# Altium project IRNAS_powerboard.PrjPcb
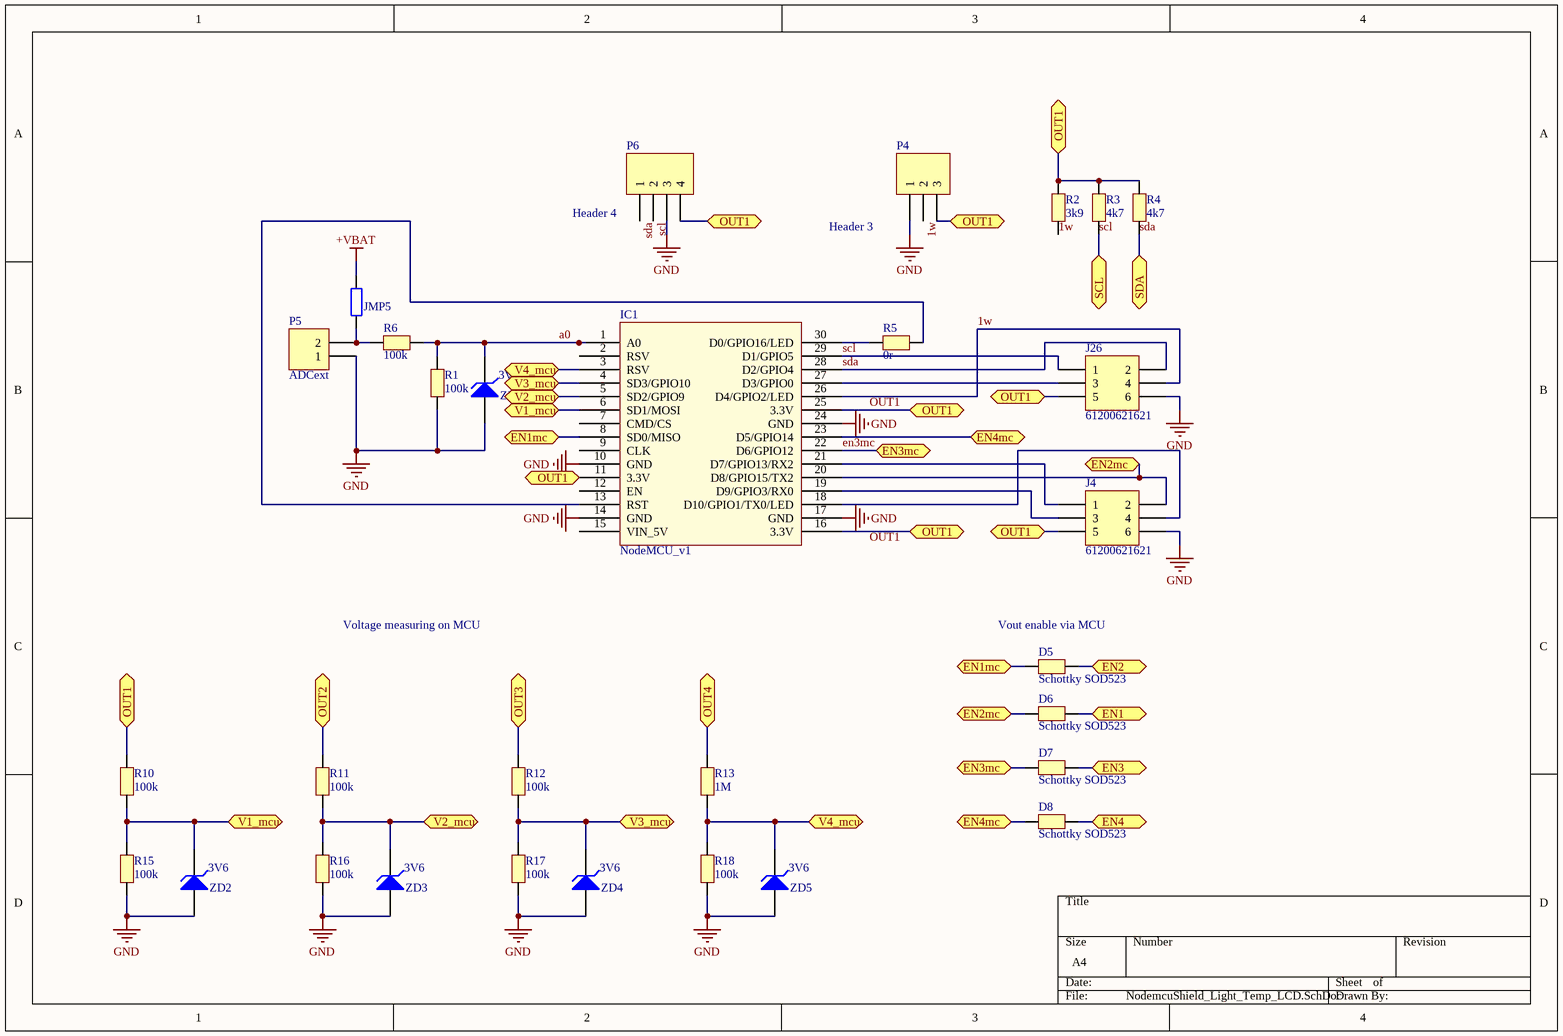
[diagram p0: NodemcuShield_Light_Temp_LCD.SchDoc]
3 sheets, 105 parts. Net scope: flat (ports and power ports of the same name join across sheets).
Board file: _Mainboard 1.1.PcbDoc
Sheets:
  NodemcuShield_Light_Temp_LCD.SchDoc
  _Mainboard.SchDoc
  Main_capacitors.SchDoc

## Sheet NodemcuShield_Light_Temp_LCD.SchDoc
size A4

### Parts
D5  Schottky SOD523  [SOD523]
D6  Schottky SOD523  [SOD523]
D7  Schottky SOD523  [SOD523]
D8  Schottky SOD523  [SOD523]
IC1  NodeMCU_v1  [Nodemcu]
J4  61200621621  [61200621621]
J26  61200621621  [61200621621]
JMP5  Resistor generic  [0603 RES]  (value not drawn)
P4  Header 3  [HDR1X3]
P5  ADCext  [HDR1X2]
P6  Header 4  [HDR1X4]
R1  100k  [0603 RES]
R2  3k9  [0603 RES]
R3  4k7  [0603 RES]
R4  4k7  [0603 RES]
R5  0r  [0603 RES]
R6  100k  [0603 RES]
R10  100k  [0603 RES]
R11  100k  [0603 RES]
R12  100k  [0603 RES]
R13  1M  [0603 RES]
R15  100k  [0603 RES]
R16  100k  [0603 RES]
R17  100k  [0603 RES]
R18  100k  [0603 RES]
ZD1  Valve: 3V6  [MELF_diode]  (hidden comment: Diode Zener)
ZD2  Valve: 3V6  [MELF_diode]  (hidden comment: Diode Zener)
ZD3  Valve: 3V6  [MELF_diode]  (hidden comment: Diode Zener)
ZD4  Valve: 3V6  [MELF_diode]  (hidden comment: Diode Zener)
ZD5  Valve: 3V6  [MELF_diode]  (hidden comment: Diode Zener)

### Ports
EN1, EN1mc, EN2, EN2mc, EN3, EN3mc, EN4, EN4mc, OUT1, OUT2, OUT3, OUT4, SCL, SDA, V1_mcu, V2_mcu, V3_mcu, V4_mcu

### Nets
+VBAT: JMP5.2
GND: IC1.10(GND) IC1.14(GND) IC1.17(GND) IC1.24(GND) J4.6 J26.6 P4.1 P5.1 P6.3 R1.2 R15.2 R16.2 R17.2 R18.2 ZD1.1(A) ZD2.1(A) ZD3.1(A) ZD4.1(A) ZD5.1(A)
1w: IC1.26(D4/GPIO2/LED) J26.4 P4.2 R2.1
a0: IC1.1(A0) R1.1 R6.1 ZD1.2(K)
en3mc: D7.2 IC1.22(D6/GPIO12) ; port EN3mc
OUT1: IC1.11(3.3V) IC1.16(3.3V) IC1.25(3.3V) J4.5 J26.5 P4.3 P6.4 R2.2 R3.2 R4.2 R10.1 ; port OUT1
scl: IC1.29(D1/GPIO5) J26.1 P6.2 R3.1 ; port SCL
sda: IC1.28(D2/GPIO4) J26.2 P6.1 R4.1 ; port SDA
NetC5_2: R11.1 ; port OUT2
NetC9_2: R12.1 ; port OUT3
NetC13_2: R13.1 ; port OUT4
NetD1_2: D8.1 ; port EN4
NetD2_2: D7.1 ; port EN3
NetD3_2: D6.1 ; port EN1
NetD4_2: D5.1 ; port EN2
NetD5_2: D5.2 IC1.8(SD0/MISO) ; port EN1mc
NetD6_2: D6.2 IC1.20(D8/GPIO15/TX2) J4.2 ; port EN2mc
NetD8_2: D8.2 IC1.23(D5/GPIO14) ; port EN4mc
NetIC1_3: IC1.3(RSV) R13.2 R18.1 ZD5.2(K) ; port V4_mcu
NetIC1_4: IC1.4(SD3/GPIO10) R12.2 R17.1 ZD4.2(K) ; port V3_mcu
NetIC1_5: IC1.5(SD2/GPIO9) R11.2 R16.1 ZD3.2(K) ; port V2_mcu
NetIC1_6: IC1.6(SD1/MOSI) R10.2 R15.1 ZD2.2(K) ; port V1_mcu
NetIC1_13: IC1.13(RST) R5.1
NetIC1_18: IC1.18(D10/GPIO1/TX0/LED) J4.4
NetIC1_19: IC1.19(D9/GPIO3/RX0) J4.3
NetIC1_21: IC1.21(D7/GPIO13/RX2) J4.1
NetIC1_27: IC1.27(D3/GPIO0) J26.3
NetIC1_30: IC1.30(D0/GPIO16/LED) R5.2
NetJMP5_1: JMP5.1 P5.2 R6.2

Not connected (* = marked no-connect by the designer): IC1 2(RSV) 7(CMD/CS) 9(CLK) 12(EN) 15(VIN_5V)

### Notes on the sheet
- Voltage measuring on MCU
- (near D5) Vout enable via MCU
- Labels drawn without touching a wire or pin: OUT1

### Library data of the parts
D5-D8 = Resistor
IC1 = NodeMCU_v1: nodemcu
J4 J26 = 61200621621: WR-BHD 2.54mm Male Box Header; Manufacturer: Wurth Elektronik; ComponentLink1 Description: Manufacturer; ComponentLink2 Description: Datasheet; NoPins: 6; Created Date: March 2016; partNo: 61200621621; ComponentLink1URL: http://www.we-online.com; ComponentLink2URL: http://katalog.we-online.de/em/datasheet/6120xx21621.pdf; Created by: Baojun Chen
JMP5 = Resistor: Resistor SMD; Valve: *
P4 = Header 3: Header, 3-Pin; LatestRevisionDate: 17-Jul-2002; LatestRevisionNote: Re-released for DXP Platform.; Publisher: Altium Limited
P5 = Header 2: Header, 2-Pin; LatestRevisionDate: 17-Jul-2002; LatestRevisionNote: Re-released for DXP Platform.; Publisher: Altium Limited
P6 = Header 4: Header, 4-Pin; LatestRevisionDate: 17-Jul-2002; LatestRevisionNote: Re-released for DXP Platform.; Publisher: Altium Limited
R1-R6 = Resistor: Resistor 0603
R10-R13 R15-R18 = Resistor: Resistor 0805 smd
ZD1-ZD5 = Diode Zener: Zener

## Sheet _Mainboard.SchDoc
size A4
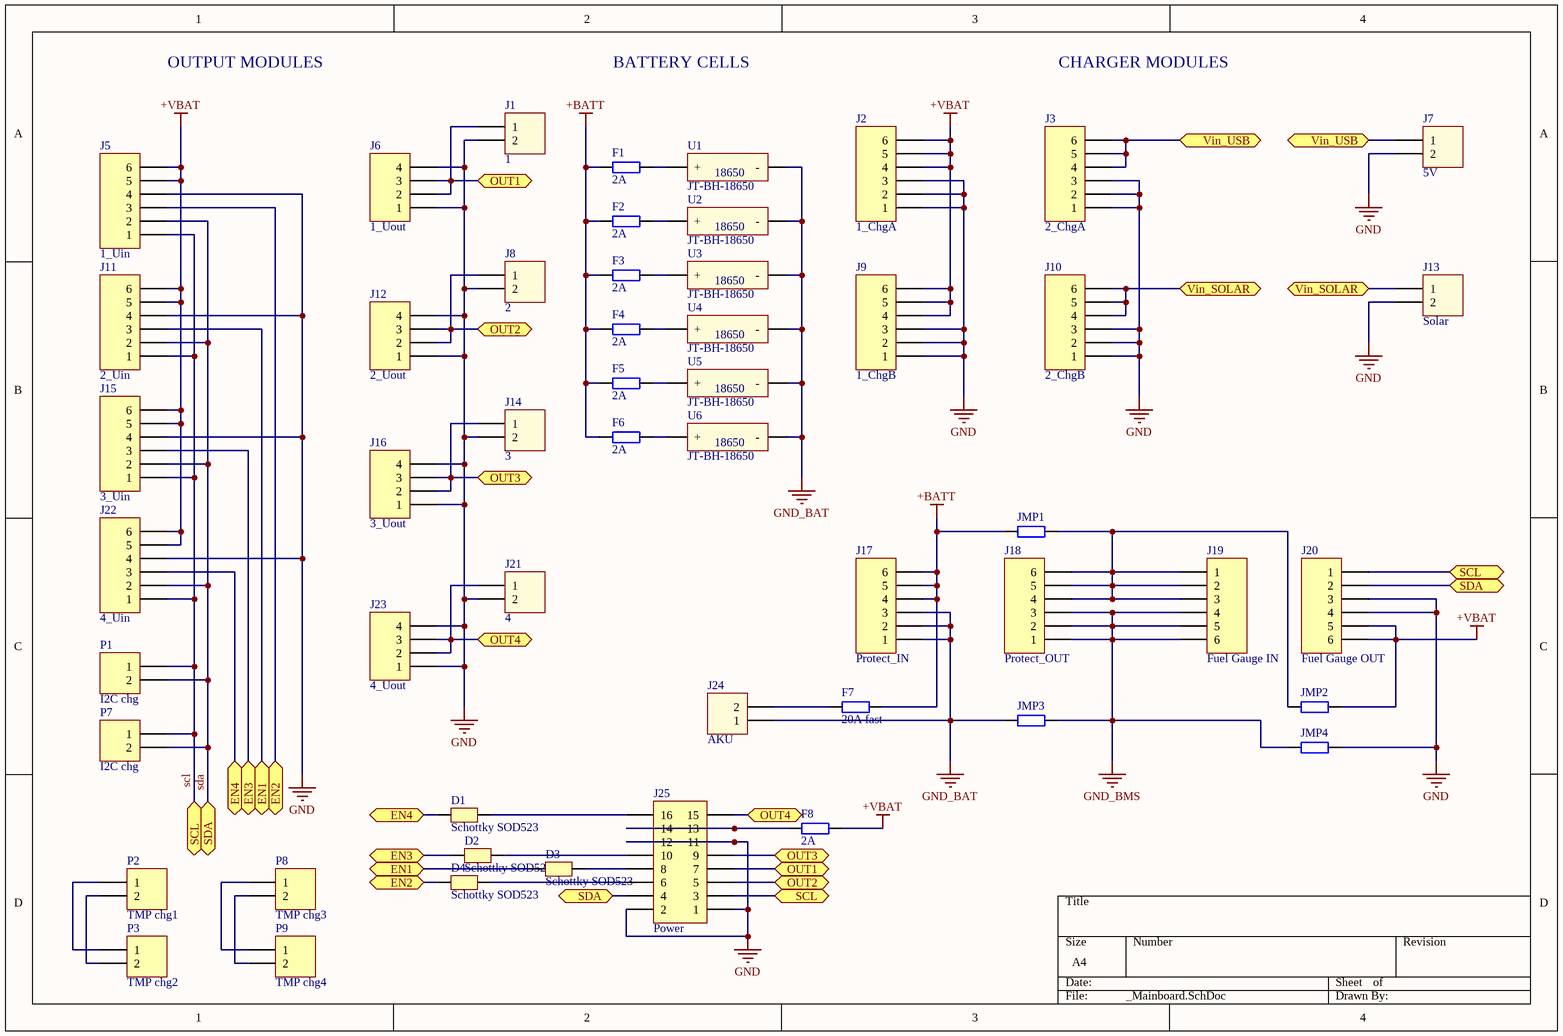
[diagram p1: _Mainboard.SchDoc]

### Parts
D1  Schottky SOD523  [SOD523]
D2  Schottky SOD523  [SOD523]
D3  Schottky SOD523  [SOD523]
D4  Schottky SOD523  [SOD523]
F1  Valve: 2A  [1206 RES]  (hidden comment: SMD fuse)
F2  Valve: 2A  [1206 RES]  (hidden comment: SMD fuse)
F3  Valve: 2A  [1206 RES]  (hidden comment: SMD fuse)
F4  Valve: 2A  [1206 RES]  (hidden comment: SMD fuse)
F5  Valve: 2A  [1206 RES]  (hidden comment: SMD fuse)
F6  Valve: 2A  [1206 RES]  (hidden comment: SMD fuse)
F7  Valve: 20A fast  [1206 RES]  (hidden comment: SMD fuse)
F8  Valve: 2A  [1206 RES]  (hidden comment: SMD Fuse)
J1  1  [691213510002]
J2  1_ChgA  [HDR1X6]
J3  2_ChgA  [HDR1X6]
J5  1_Uin  [HDR1X6]
J6  1_Uout  [HDR1X4]
J7  5V  [691213510002]
J8  2  [691213510002]
J9  1_ChgB  [HDR1X6]
J10  2_ChgB  [HDR1X6]
J11  2_Uin  [HDR1X6]
J12  2_Uout  [HDR1X4]
J13  Solar  [691213510002]
J14  3  [691213510002]
J15  3_Uin  [HDR1X6]
J16  3_Uout  [HDR1X4]
J17  Protect_IN  [HDR1X6]
J18  Protect_OUT  [HDR1X6]
J19  Fuel Gauge IN  [HDR1X6]
J20  Fuel Gauge OUT  [HDR1X6]
J21  4  [691213510002]
J22  4_Uin  [HDR1X6]
J23  4_Uout  [HDR1X4]
J24  AKU  [691213510002]
J25  Power  [61201621621]
JMP1  Resistor generic  [0603 RES]  (value not drawn)
JMP2  Resistor generic  [0603 RES]  (value not drawn)
JMP3  Resistor generic  [0603 RES]  (value not drawn)
JMP4  Resistor generic  [0603 RES]  (value not drawn)
P1  I2C chg  [HDR1X2]
P2  TMP chg1  [HDR1X2]
P3  TMP chg2  [HDR1X2]
P7  I2C chg  [HDR1X2]
P8  TMP chg3  [HDR1X2]
P9  TMP chg4  [HDR1X2]
U1  JT-BH-18650  [18650 holder]
U2  JT-BH-18650  [18650 holder]
U3  JT-BH-18650  [18650 holder]
U4  JT-BH-18650  [18650 holder]
U5  JT-BH-18650  [18650 holder]
U6  JT-BH-18650  [18650 holder]

### Ports
EN1, EN2, EN3, EN4, OUT1, OUT2, OUT3, OUT4, SCL, SDA, Vin_SOLAR, Vin_USB

### Nets
+BATT: F1.1 F2.1 F3.1 F4.1 F5.1 F6.1 F7.2 J17.4 J17.5 J17.6 JMP1.1
+VBAT: F8.2 J2.4 J2.5 J2.6 J5.5 J5.6 J9.4 J9.5 J9.6 J11.5 J11.6 J15.5 J15.6 J20.5 J20.6 J22.5 J22.6 JMP2.2
GND: J1.2 J2.1 J2.2 J2.3 J3.1 J3.2 J3.3 J5.4 J6.1 J6.4 J7.2 J8.2 J9.1 J9.2 J9.3 J10.1 J10.2 J10.3 J11.4 J12.1 J12.4 J13.2 J14.2 J15.4 J16.1 J16.4 J20.3 J20.4 J21.2 J22.4 J23.1 J23.4 J25.1 J25.2 J25.11 J25.12 JMP4.2
GND_BAT: J17.1 J17.2 J17.3 J24.1 JMP3.1 U1.2(-) U2.2(-) U3.2(-) U4.2(-) U5.2(-) U6.2(-)
GND_BMS: J18.1 J18.2 J18.3 J19.4 J19.5 J19.6 JMP3.2 JMP4.1
OUT1: J1.1 J6.2 J6.3 J25.7 ; port OUT1
scl: J5.1 J11.1 J15.1 J20.1 J22.1 J25.3 P1.1 P7.1 ; port SCL
sda: J5.2 J11.2 J15.2 J20.2 J22.2 J25.4 P1.2 P7.2 ; port SDA
NetC5_2: J8.1 J12.2 J12.3 J25.5 ; port OUT2
NetC9_2: J14.1 J16.2 J16.3 J25.9 ; port OUT3
NetC13_2: J21.1 J23.2 J23.3 J25.15 ; port OUT4
NetD1_1: D1.1 J25.16
NetD1_2: D1.2 J22.3 ; port EN4
NetD2_1: D2.1 J25.10
NetD2_2: D2.2 J15.3 ; port EN3
NetD3_1: D3.1 J25.8
NetD3_2: D3.2 J11.3 ; port EN1
NetD4_1: D4.1 J25.6
NetD4_2: D4.2 J5.3 ; port EN2
NetF1_2: F1.2 U1.1(+)
NetF2_2: F2.2 U2.1(+)
NetF3_2: F3.2 U3.1(+)
NetF4_2: F4.2 U4.1(+)
NetF5_2: F5.2 U5.1(+)
NetF6_2: F6.2 U6.1(+)
NetF7_1: F7.1 J24.2
NetF8_1: F8.1 J25.13 J25.14
NetJ3_4: J3.4 J3.5 J3.6 J7.1 ; port Vin_USB
NetJ10_4: J10.4 J10.5 J10.6 J13.1 ; port Vin_SOLAR
NetJ18_4: J18.4 J18.5 J18.6 J19.1 J19.2 J19.3 JMP1.2 JMP2.1
NetP2_1: P2.1 P3.1
NetP2_2: P2.2 P3.2
NetP8_1: P8.1 P9.1
NetP8_2: P8.2 P9.2

### Notes on the sheet
- OUTPUT MODULES
- BATTERY CELLS
- CHARGER MODULES
- (in symbol 18650 holder) 18650

### Library data of the parts
D1-D4 F1-F6 F8 = Resistor
F7 = Resistor: Farnell  1832127; Code: Littlefuse 1206SFH200F/24-2; Farnell: 1832127
J1 J7 J13 J14 J21 J24 = 691213510002: 2P 5.08 screw terminal; Pitch: 5.08 mm; Pin Number: 2; ComponentLink1Description: Manufacturer; ComponentLink1URL: http://www.we-online.de; ComponentLink2Description: Datasheet; ComponentLink2URL: http://katalog.we-online.de/em/datasheet/6912135100XX.pdf; Part Number: 691213510002; Published Date: March 2017; Publisher: Wurth Elektronik
J2 J3 J5 J9-J11 J15 J17-J20 J22 = Header 6: Header, 6-Pin
J6 J12 J16 J23 = Header 4: Header, 4-Pin; LatestRevisionDate: 17-Jul-2002; LatestRevisionNote: Re-released for DXP Platform.; Publisher: Altium Limited
J8 = 691213510002: 2P 5.08 screw terminal; Pitch: 5.08 mm; ComponentLink1Description: Manufacturer; ComponentLink1URL: http://www.we-online.de; ComponentLink2Description: Datasheet; ComponentLink2URL: http://katalog.we-online.de/em/datasheet/6912135100XX.pdf; Part Number: 691213510002; Published Date: March 2017; Publisher: Wurth Elektronik; Pin Number: 2
J25 = 61201621621: WR-BHD 2.54mm Male Box Header; Manufacturer: Wurth Elektronik; ComponentLink1 Description: Manufacturer; ComponentLink2 Description: Datasheet; NoPins: 16; Created Date: March 2016; partNo: 61201621621; ComponentLink1URL: http://www.we-online.com; ComponentLink2URL: http://katalog.we-online.de/em/datasheet/6120xx21621.pdf; Created by: Baojun Chen
JMP1-JMP4 = Resistor: Resistor SMD; Valve: *
P1-P3 P7-P9 = Header 2: Header, 2-Pin; LatestRevisionDate: 17-Jul-2002; LatestRevisionNote: Re-released for DXP Platform.; Publisher: Altium Limited
U1-U6 = 18650 holder: Producer: http://jiatelcn.com

## Sheet Main_capacitors.SchDoc
size A4
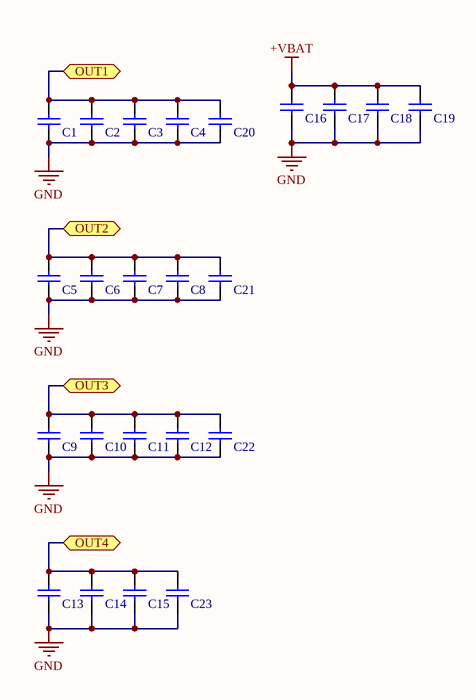
[diagram p2: Main_capacitors.SchDoc]

### Parts
C1  Capacitor NP  [2512 CAP]  (value not drawn)
C2  Capacitor NP  [2512 CAP]  (value not drawn)
C3  Capacitor NP  [2512 CAP]  (value not drawn)
C4  Capacitor NP  [2512 CAP]  (value not drawn)
C5  Capacitor NP  [2512 CAP]  (value not drawn)
C6  Capacitor NP  [2512 CAP]  (value not drawn)
C7  Capacitor NP  [2512 CAP]  (value not drawn)
C8  Capacitor NP  [2512 CAP]  (value not drawn)
C9  Capacitor NP  [2512 CAP]  (value not drawn)
C10  Capacitor NP  [2512 CAP]  (value not drawn)
C11  Capacitor NP  [2512 CAP]  (value not drawn)
C12  Capacitor NP  [2512 CAP]  (value not drawn)
C13  Capacitor NP  [2512 CAP]  (value not drawn)
C14  Capacitor NP  [2512 CAP]  (value not drawn)
C15  Capacitor NP  [2512 CAP]  (value not drawn)
C16  Capacitor NP  [2512 CAP]  (value not drawn)
C17  Capacitor NP  [2512 CAP]  (value not drawn)
C18  Capacitor NP  [2512 CAP]  (value not drawn)
C19  Capacitor NP  [2512 CAP]  (value not drawn)
C20  Capacitor NP  [0805 CAP]  (value not drawn)
C21  Capacitor NP  [0805 CAP]  (value not drawn)
C22  Capacitor NP  [0805 CAP]  (value not drawn)
C23  Capacitor NP  [0805 CAP]  (value not drawn)

### Ports
OUT1, OUT2, OUT3, OUT4

### Nets
+VBAT: C16.2 C17.2 C18.2 C19.2
GND: C1.1 C2.1 C3.1 C4.1 C5.1 C6.1 C7.1 C8.1 C9.1 C10.1 C11.1 C12.1 C13.1 C14.1 C15.1 C16.1 C17.1 C18.1 C19.1 C20.1 C21.1 C22.1 C23.1
OUT1: C1.2 C2.2 C3.2 C4.2 C20.2 ; port OUT1
NetC5_2: C5.2 C6.2 C7.2 C8.2 C21.2 ; port OUT2
NetC9_2: C9.2 C10.2 C11.2 C12.2 C22.2 ; port OUT3
NetC13_2: C13.2 C14.2 C15.2 C23.2 ; port OUT4

### Library data of the parts
C20-C23 = Capacitor NP: Valve: 100nF; Voltage: *
C1-C19 = Capacitor NP: Voltage: *; Valve: *

## Nets that join several sheets
+VBAT: NodemcuShield_Light_Temp_LCD (JMP5.2), _Mainboard (18 pins), Main_capacitors (C16.2 C17.2 C18.2 C19.2)
GND: NodemcuShield_Light_Temp_LCD (19 pins), _Mainboard (37 pins), Main_capacitors (23 pins)
NetC5_2: NodemcuShield_Light_Temp_LCD (R11.1), _Mainboard (J8.1 J12.2 J12.3 J25.5), Main_capacitors (5 pins)
NetC9_2: NodemcuShield_Light_Temp_LCD (R12.1), _Mainboard (J14.1 J16.2 J16.3 J25.9), Main_capacitors (5 pins)
NetC13_2: NodemcuShield_Light_Temp_LCD (R13.1), _Mainboard (J21.1 J23.2 J23.3 J25.15), Main_capacitors (C13.2 C14.2 C15.2 C23.2)
NetD1_2: NodemcuShield_Light_Temp_LCD (D8.1), _Mainboard (D1.2 J22.3)
NetD2_2: NodemcuShield_Light_Temp_LCD (D7.1), _Mainboard (D2.2 J15.3)
NetD3_2: NodemcuShield_Light_Temp_LCD (D6.1), _Mainboard (D3.2 J11.3)
NetD4_2: NodemcuShield_Light_Temp_LCD (D5.1), _Mainboard (D4.2 J5.3)
OUT1: NodemcuShield_Light_Temp_LCD (11 pins), _Mainboard (J1.1 J6.2 J6.3 J25.7), Main_capacitors (5 pins)
scl: NodemcuShield_Light_Temp_LCD (IC1.29 J26.1 P6.2 R3.1), _Mainboard (8 pins)
sda: NodemcuShield_Light_Temp_LCD (IC1.28 J26.2 P6.1 R4.1), _Mainboard (8 pins)

## Assembly variants
Main board - normal: not fitted IC1 JMP1 JMP2 JMP3 JMP4 JMP5 P3 R10 R11 R12 R13 R15 R16 R17 R18 U1 U2 U3 U4 U5 U6 ZD2 ZD3 ZD4 ZD5